# EAGLE design MinipHV3_2 (EAGLE 6.3)
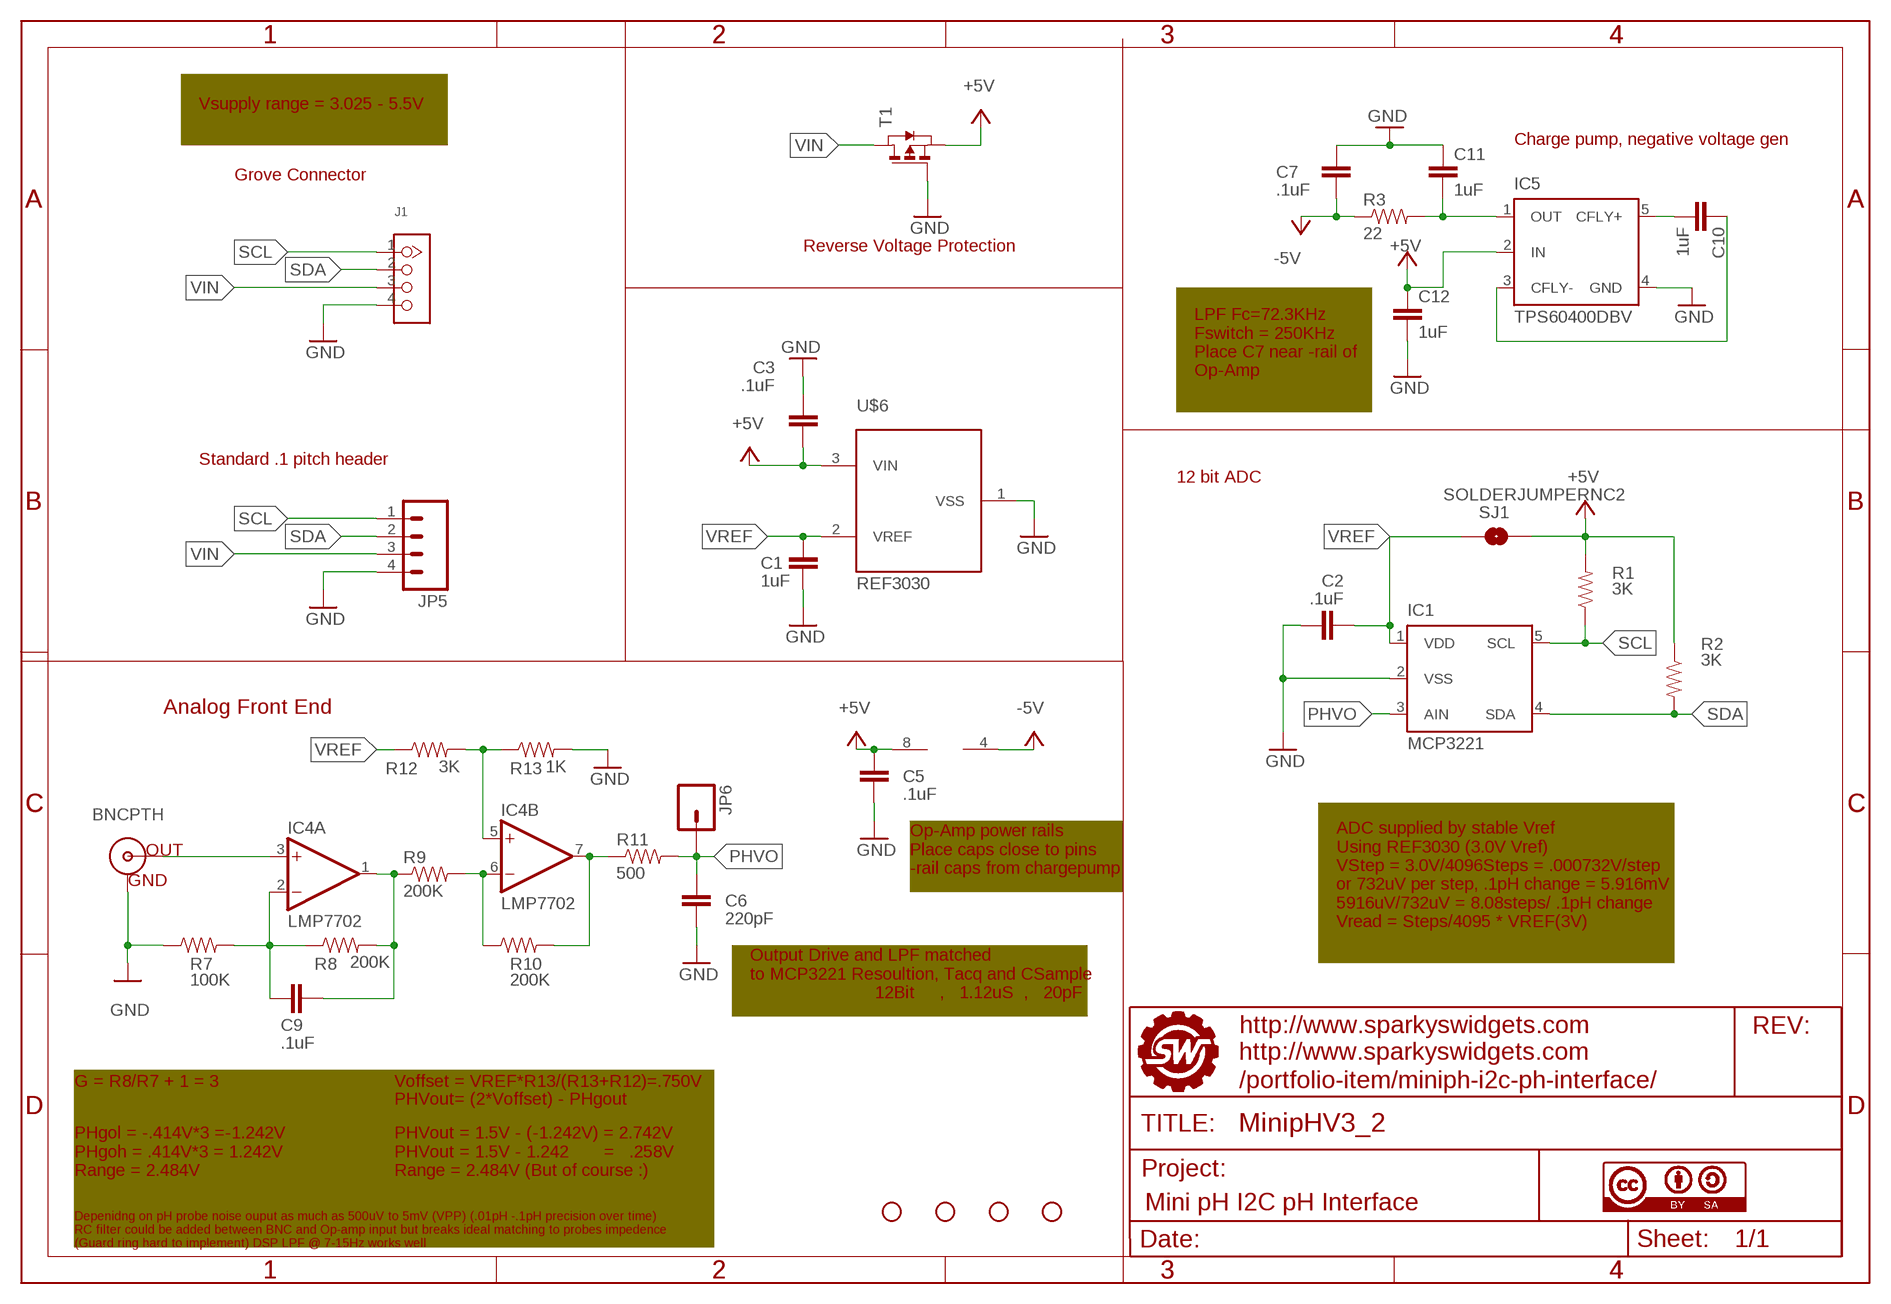
[diagram p0: schematic, sheet 1]

## Parts
C1  1uF  CAP0805  [0805]
C2  .1uF  CAP0805  [0805]
C3  .1uF  CAP0805  [0805]
C5  .1uF  CAP0805  [0805]
C6  220pF  CAP0805  [0805]
C7  .1uF  CAP0805  [0805]
C9  .1uF  CAP0805  [0805]
C10  1uF  CAP0805  [0805]
C11  1uF  CAP0805  [0805]
C12  1uF  CAP0805  [0805]
IC1  MCP3221  [SOT23-DBV]
IC4  LMP7702  LM358D  [SO08]
IC5  TPS60400DBV  [SOT23-DBV]
J1  TWIG-4P-2.0-2.0  [4P-2.0]
JP1  STAND-OFF  [STAND-OFF]
JP2  STAND-OFF  [STAND-OFF]
JP3  STAND-OFF  [STAND-OFF]
JP4  STAND-OFF  [STAND-OFF]
JP5  M04PTH  [1X04]
JP6  M01PTH  [1X01]
R1  3K  RESISTOR0805-RES  [0805]
R2  3K  RESISTOR0805-RES  [0805]
R3  22  RESISTOR0805-RES  [0805]
R7  100K  RESISTOR0805-RES  [0805]
R8  200K  RESISTOR0805-RES  [0805]
R9  200K  RESISTOR0805-RES  [0805]
R10  200K  RESISTOR0805-RES  [0805]
R11  500  RESISTOR0805-RES  [0805]
R12  3K  RESISTOR0805-RES  [0805]
R13  1K  RESISTOR0805-RES  [0805]
SJ1  SOLDERJUMPERNC2  [SJ_2S-NOTRACE]
T1  PMOSSOT23  [SOT-23]
U$2  BNCPTH  [BNC]
U$4  FRAME_MINIPH  [SWPCBLOGOWITHINFO]
U$5  CC-BY-SA  [CC-BY-SA]
U$6  REF3030  MCP1541  [SOT-23]

## Nets
+5V: C3.1 C5.1 C12.1 IC4.8(P:V+) IC5.2(IN) R1.2 R2.1 SJ1.2 T1.2(S) U$6.3(VIN)
-5V: C7.2 IC4.4(P:V-) R3.1
GND: C1.2 C2.1 C3.2 C5.2 C6.2 C7.1 C11.1 C12.2 IC1.2(VSS) IC5.4(GND) J1.4 JP5.4 R7.1 R13.2 T1.3(G) U$2.GND U$6.1(VSS)
N$1: IC4.5(B:+IN) R12.2 R13.1
N$2: IC4.7(B:OUT) R10.2 R11.1
N$3: IC4.6(B:-IN) R9.2 R10.1
N$4: C11.2 IC5.1(OUT) R3.2
N$5: C9.2 IC4.2(A:-IN) R7.2 R8.1
N$7: IC4.3(A:+IN) U$2.S(OUT)
N$10: C9.1 IC4.1(A:OUT) R8.2 R9.1
N$22: C10.1 IC5.3(CFLY-)
N$23: C10.2 IC5.5(CFLY+)
PHVO: C6.1 IC1.3(AIN) JP6.1 R11.2
SCL: IC1.5(SCL) J1.1 JP5.1 R1.1
SDA: IC1.4(SDA) J1.2 JP5.2 R2.2
VIN: J1.3 JP5.3 T1.1(D)
VREF: C1.1 C2.2 IC1.1(VDD) R12.1 SJ1.1 U$6.2(VREF)

## Notes on the sheet
- Vsupply range = 3.025 - 5.5V
- Charge pump, negative voltage gen
- Grove Connector
- Reverse Voltage Protection
- LPF Fc=72.3KHz
  Fswitch = 250KHz
  Place C7 near -rail of
  Op-Amp
- Standard .1 pitch header
- 12 bit ADC
- Analog Front End
- Op-Amp power rails
  Place caps close to pins
  -rail caps from chargepump
- ADC supplied by stable Vref
  Using REF3030 (3.0V Vref)
  VStep = 3.0V/4096Steps = .000732V/step
  or 732uV per step, .1pH change = 5.916mV
  5916uV/732uV = 8.08steps/ .1pH change
  Vread = Steps/4095 * VREF(3V)
- Output Drive and LPF matched
  to MCP3221 Resoultion, Tacq and CSample
                           12Bit     ,   1.12uS  ,   20pF
- G = R8/R7 + 1 = 3 | Voffset = VREF*R13/(R13+R12)=.750V
- PHVout= (2*Voffset) - PHgout
- PHgol = -.414V*3 =-1.242V
  PHgoh = .414V*3 = 1.242V
  Range = 2.484V
- PHVout = 1.5V - (-1.242V) = 2.742V
  PHVout = 1.5V - 1.242       =   .258V
  Range = 2.484V (But of course :)
- Depenidng on pH probe noise ouput as much as 500uV to 5mV (VPP) (.01pH -.1pH precision over time)
  RC filter could be added between BNC and Op-amp input but breaks ideal matching to probes impedence
  (Guard ring hard to implement) DSP LPF @ 7-15Hz works well

## Library data of the parts
C1-C3 C5-C7 C9-C12 = SparkysWidgets:CAP: Capacitor Standard 0603 ceramic capacitor, and 0.1" leaded capacitor.
IC1 = SparkysWidgets:MCP3221: 12 bit I2C ADC Low power 12-bit I2c ADC from MicroChip upto 22.3KSPS Source: http://ww1.microchip.com/downloads/en/DeviceDoc/21732b.pdf
IC4 = SparkysWidgets:LM358: OP AMP also LM158; LM258; LM2904 Source: http://cache.national.com/ds/LM/LM158.pdf
IC5 = SparkysWidgets:TPS60400DBV: UNREGULATED CHARGE PUMP VOLTAGE INVERTER 60-mA unregultated charge pump voltage inverter Source: http://focus.ti.com/lit/ds/symlink/tps6040i.pdf
J1 = Connector:TWIG-4P-2.0
JP1-JP4 = SparkFun:STAND-OFF: Stand Off This is the mechanical footprint for a #4 phillips button head screw. Use the keepout ring to avoid running the screw head into surrounding components. SKU : PRT-00447
JP5 = SparkFun:M04: Header 4 Standard 4-pin 0.1" header. Use with straight break away headers (SKU : PRT-00116), right angle break away headers (PRT-00553), swiss pins (PRT-00743), machine pins (PRT-00117), and female headers (PRT-00115). Molex polarized connector foot print use with SKU : PRT-08231 with associated crimp pins and housings. 1MM SMD Version SKU: PRT-10208
JP6 = SparkFun:M01: Header 1 Standard 1-pin 0.1" header. Use with straight break away headers (SKU : PRT-00116), right angle break away headers (PRT-00553), swiss pins (PRT-00743), machine pins (PRT-00117), and female headers (PRT-00115).
R1-R3 R7-R13 = SparkysWidgets:RESISTOR: Resistor Basic schematic elements and footprints for 0603, 1206, and PTH resistors.
SJ1 = SparkFun:SOLDERJUMPER: Solder Jumper Standard SMD solder jumper. Used to automate production. Two varients : Normally Open and Normally Closed are the same, but have different paste layers. NC will have a large amount of paste and should jumper during reflow.
T1 = SparkysWidgets:PMOSSOT23: MOS FET
U$2 = SparkysWidgets:BNC: BNC Connector, Mouser Part# 5227161
U$4 = SparkysWidgets:FRAME_MINIPH: A4 Sparky's Widgets frame This is a standard A4 Frame, the Doc Field has been modified with our Logo and contains the license and extra project information!; PROJECT: Mini pH I2C pH Interface; URL1: /portfolio-item/miniph-i2c-ph-interface/; URLHOME: http://www.sparkyswidgets.com; URLPROJECT: http://www.sparkyswidgets.com
U$5 = SparkysWidgets:CC-BY-SA
U$6 = SparkysWidgets:MCP1541

## Board
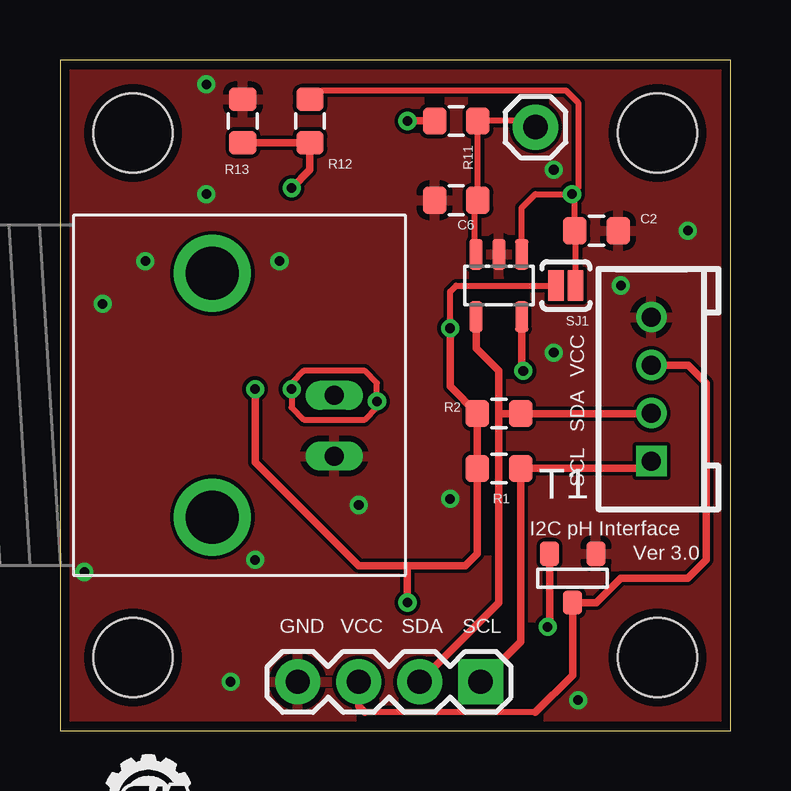
[diagram p1: board, top side]
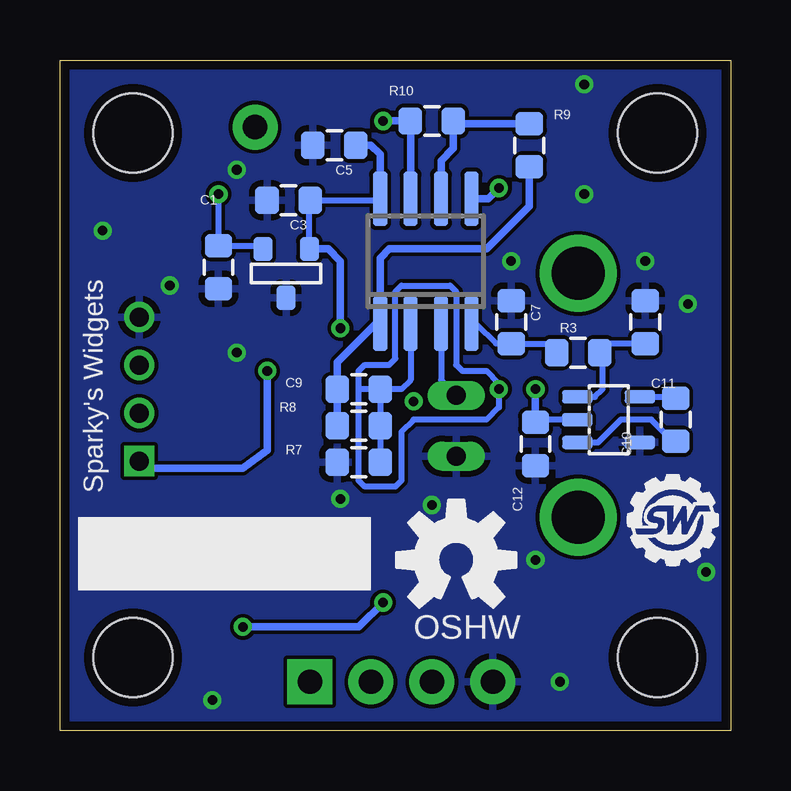
[diagram p2: board, bottom side, seen from below]

Size 27.94 x 27.94 mm. Coordinates in mm from the lower left corner, seen from the top.
Outline: 0,0 27.94,0 27.94,27.94 0,27.94 0,0
Copper layers (1*16): Top 0.0356mm / dielectric 1.5011mm / Bottom 0.0356mm
Design rules "LaenPCBOrder": minimum track width 6mil, minimum drill 13mil, track to track 6mil, track to pad 6mil, pad to pad 6mil, via to via 6mil, smd to smd 6mil, copper to edge 15mil, drill to drill 6mil, minimum pad ring 7mil, minimum via ring 7mil, stop-mask expansion 4mil, vias tented up to drill 0mil, thermal gap 10mil

### Footprints (pad centres in the part's own frame; a part is rotated, then mirrored left to right if it is on the bottom)
0805 = smd 0.984 x 1.143: 1 -0.9,0; 2 0.9,0
SOT23-DBV = smd 0.55 x 1.27: 1 -0.95,-1.3; 2 0,-1.3; 3 0.95,-1.3; 4 0.95,1.3; 5 -0.95,1.3
SO08 = smd 0.6 x 2.286: 1 -1.905,-2.6; 2 -0.635,-2.6; 3 0.635,-2.6; 4 1.905,-2.6; 5 1.905,2.6; 6 0.635,2.6; 7 -0.635,2.6; 8 -1.905,2.6
4P-2.0 = drill 0.8 pad 1.27 square: 1 -3,0 | drill 0.8 pad 1.27: 2 -1,0; 3 1,0; 4 3,0
STAND-OFF = hole 3.302: 0,0
1X04 = drill 1.016 pad 1.88 square: 1 0,0 | drill 1.016 pad 1.88: 2 2.54,0; 3 5.08,0; 4 7.62,0
1X01 = drill 1.016 pad 1.88: 1 0,0
SJ_2S-NOTRACE = smd 0.635 x 1.27: 1 -0.401,0; 2 0.413,0
SOT-23 = smd 0.787 x 1.016: 1 0.025,-1.016; 2 -0.94,1.016; 3 0.991,1.016
BNC = drill 2.2: 3 -5.08,5.08; 4 5.08,5.08 | drill 0.8 long: GND -2.54,0; S 0,0

### Placement (x,y rotation side)
C1  21.34,19.3 270 bottom
C2  22.35,20.83 180 top
C3  18.41,22.1 180 bottom
C5  16.51,24.38 180 bottom
C6  16.51,22.1 180 top
C7  9.14,17.02 270 bottom
C9  15.49,14.22 0 bottom
C10  2.29,12.95 90 bottom
C11  3.56,17.02 270 bottom
C12  8.13,11.94 270 bottom
IC1  18.29,18.54 180 top
IC4  12.7,19.56 0 bottom
IC5  5.08,12.95 270 bottom
J1  24.64,14.22 90 top
JP1  3.05,3.05 0 top
JP2  24.89,3.05 0 top
JP3  3.05,24.89 0 top
JP4  24.89,24.89 0 top
JP5  17.53,2.03 180 top
JP6  19.81,25.15 0 top
R1  18.29,10.92 180 top
R2  18.29,13.21 0 top
R3  6.35,15.75 0 bottom
R7  15.49,11.18 0 bottom
R8  15.49,12.7 180 bottom
R9  8.38,24.38 90 bottom
R10  12.45,25.4 180 bottom
R11  16.51,25.4 0 top
R12  10.41,25.4 270 top
R13  7.62,25.4 90 top
SJ1  21.08,18.54 180 top
T1  21.34,6.35 0 top
U$1  [SWPCBLOGO]  4.32,6.86 0 bottom
U$2  11.43,13.97 90 top
U$3  [OSHW-LOGO-M]  11.43,7.11 0 bottom
U$4  1.78,-4.83 0 top  (outside the outline)
U$5  2.03,-10.92 0 top  (outside the outline)
U$6  18.54,19.05 0 bottom

### Tracks (layer width: path | path; a pad name or v marks a point on that pad's centre or on a via)
+5V  (via drill 0.4)
  Top 0.254: v16.26,16.76 16.26,18.29 16.51,18.54 SJ1.2
  Top 0.305: v8.13,14.22 8.13,11.18 12.45,6.86 14.48,6.86 | v16.26,16.76 16.26,14.34 R2.1 R1.2 17.39,7.37 16.88,6.86 14.48,6.86 | T1.2 20.4,4.39 v20.32,4.32 | v14.48,5.33 14.48,6.86
  Bottom 0.254: IC5.2 8.01,12.95 C12.1 | U$6.3 17.55,22.06 C3.1 14.66,22.1 IC4.8
  Bottom 0.305: v8.13,14.22 C12.1 | v16.26,16.76 16.26,19.56 16.76,20.07 U$6.3 | IC4.8 14.61,24 14.99,24.38 C5.1 | v20.32,4.32 15.49,4.32 v14.48,5.33
-5V
  Bottom 0.254: R3.1 7.62,16.12 C7.2 9.77,16.12 10.61,16.96 IC4.4
GND  (via drill 0.4)
  other vias: 8.13,7.11 16.26,9.65 1.78,17.78 3.56,19.56 9.14,19.56 12.45,9.4 1.02,6.6 7.11,2.03 23.37,18.54 20.57,23.37 20.57,15.75 21.59,1.27 6.1,26.92 6.1,22.35 26.16,20.83
  pour Top: -0.25,28.19 -0.25,-0.25 28.19,-0.25 28.19,28.19
  pour Bottom: -0.76,28.7 -0.76,-1.02 28.7,-0.76 28.7,28.7
N$1  (via drill 0.4)
  Top 0.305: R13.1 R12.2 10.41,23.37 v9.65,22.61
  Bottom 0.305: 9.91,22.35 v9.65,22.61 10.1,22.16 IC4.5
N$2  (via drill 0.4)
  Top 0.305: v14.48,25.4 R11.1
  Bottom 0.305: IC4.7 13.34,25.39 R10.2 v14.48,25.4
N$3
  Bottom 0.305: R9.2 11.43,25.28 R10.1 11.55,24.27 12.06,23.75 IC4.6
N$4
  Bottom 0.254: IC5.1 5.65,13.9 5.33,14.22 5.33,15.63 R3.2 5.08,16.12 C11.2
N$5  (via drill 0.4)
  Top 0.254: 10.16,14.99 9.65,14.48 v9.65,14.22 9.65,13.46 10.16,12.95 12.7,12.95 13.21,13.46 v13.21,13.72 13.21,14.48 12.7,14.99 10.16,14.99
  Bottom 0.254: 15.49,14.22 15.49,10.41 15.24,10.16 13.97,10.16 13.72,10.41 13.72,12.45 13.21,12.95 10.16,12.95 9.65,13.46 v9.65,14.22 9.65,14.48 10.16,14.99 11.18,14.99 11.43,15.24 11.43,18.29 11.68,18.54 13.72,18.54 13.97,18.29 13.97,15.49 14.22,15.24 15.24,15.24 15.49,14.99 15.49,14.22 | IC4.2 13.34,14.61 13.72,14.22 C9.2 | C9.2 R8.1 R7.2 | C9.2 15.49,14.22
N$7
  Bottom 0.254: IC4.3 12.06,14.61 U$2.S
N$10
  Bottom 0.305: R8.2 C9.1 16.39,15.36 14.79,16.96 IC4.1 14.61,19.68 14.22,20.07 10.16,20.07 8.38,21.84 R9.1
N$22
  Bottom 0.254: C10.1 2.4,12.05 3.3,12.95 4.57,12.95 5.52,12 IC5.3
N$23
  Bottom 0.254: IC5.5 2.34,13.9 C10.2
PHVO
  Top 0.254: IC1.3 17.28,20.15 17.28,22.23 C6.1 R11.2 19.56,25.4 JP6.1
SCL  (via drill 0.4)
  Top 0.305: JP5.1 19.19,3.69 R1.1 24.34,10.92 J1.1 | IC1.5 19.24,15.05 v19.3,14.99
  Bottom 0.305: J1.1 24.64,11.18 24.38,10.92 20.32,10.92 19.3,11.68 v19.3,14.99
SDA
  Top 0.305: J1.2 24.62,13.21 R2.2 18.29,13.21 | JP5.2 18.29,5.33 18.29,13.21 | 18.29,13.21 18.29,14.99 17.34,15.94 IC1.4
VIN
  Top 0.254: 19.81,0.76 12.7,0.76
  Top 0.305: 19.81,0.76 21.36,2.31 T1.1 22.35,5.33 23.37,6.35 26.16,6.35 26.92,7.11 26.92,14.48 26.18,15.22 J1.3 | 12.7,0.76 12.45,1.02 JP5.3
VREF  (via drill 0.4)
  Top 0.254: v21.34,22.35 21.45,22.24 C2.2 21.48,20.8 SJ1.1 | IC1.1 19.24,21.78 19.81,22.35 v21.34,22.35 | R12.1 10.55,26.3 10.92,26.67 21.08,26.67 21.59,26.16 21.59,22.61 v21.34,22.35
  Bottom 0.254: v21.34,22.35 C1.1 19.62,20.2 U$6.2

### Text on the board
tPlace: VCC | SDA | SCL | I2C pH Interface | Ver 3.0 | GND | VCC | SDA | SCL
bPlace: Sparky's Widgets | OSHW